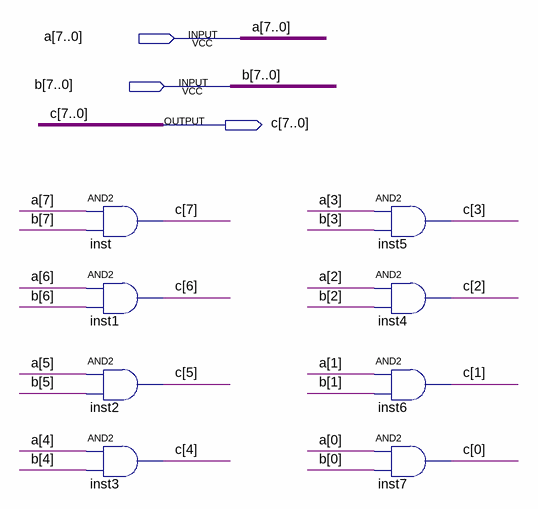
[diagram p0: schematic sheet]
// Quartus schematic and8bit.bdf as structural Verilog: 8 symbols, 3 pins
module and8bit (
  input  [7:0] a,
  input  [7:0] b,
  output [7:0] c
);

  and inst (c[7], a[7], b[7]);
  and inst1 (c[6], a[6], b[6]);
  and inst2 (c[5], a[5], b[5]);
  and inst3 (c[4], a[4], b[4]);
  and inst5 (c[3], a[3], b[3]);
  and inst4 (c[2], a[2], b[2]);
  and inst6 (c[1], a[1], b[1]);
  and inst7 (c[0], a[0], b[0]);
endmodule
